# EasyEDA Pro project C题视觉追踪板子1.eprj, board PCB3
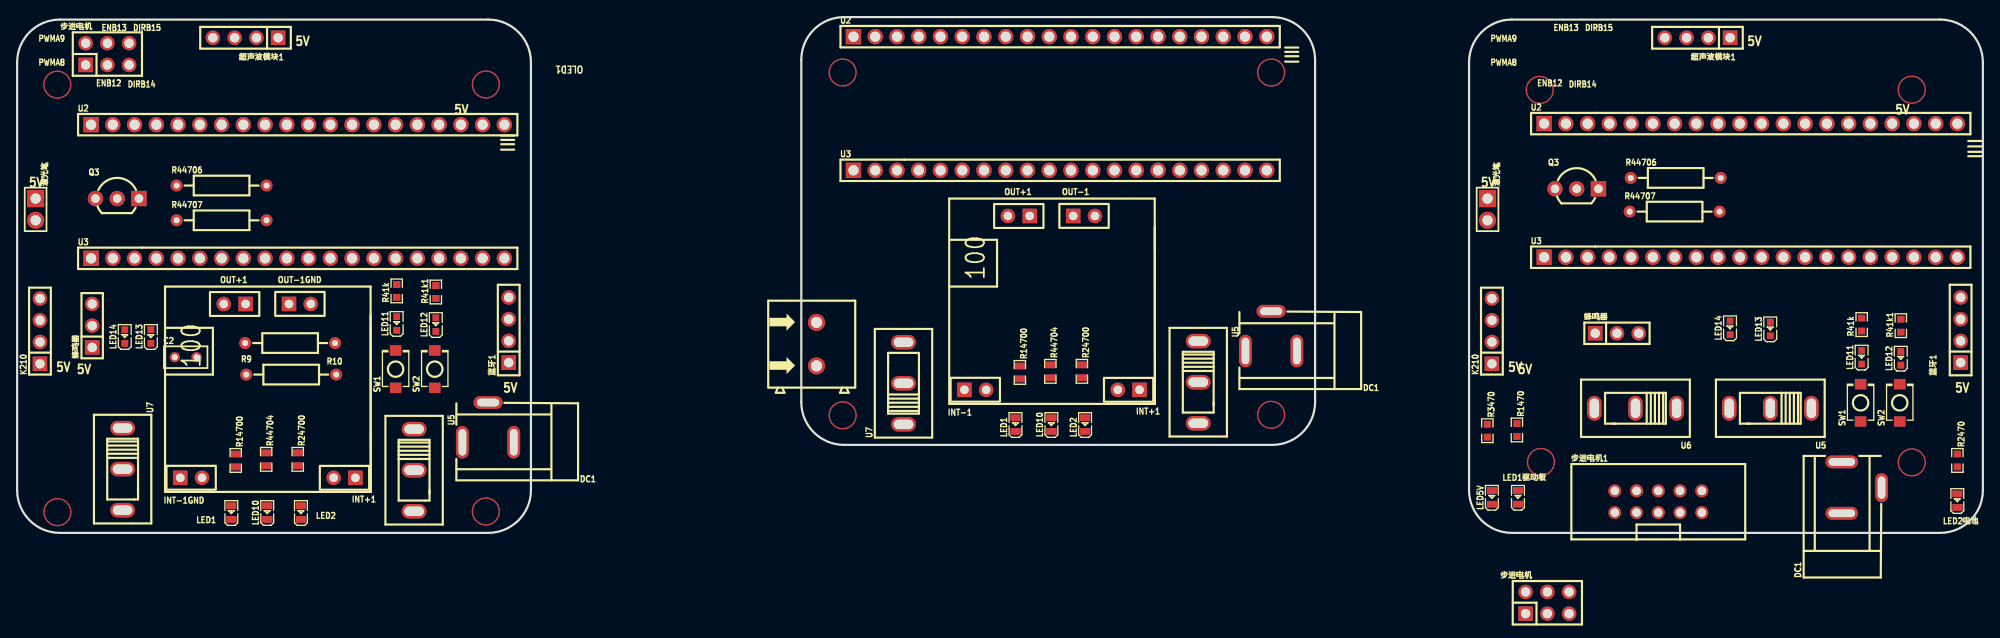
[diagram p4: board, top side]
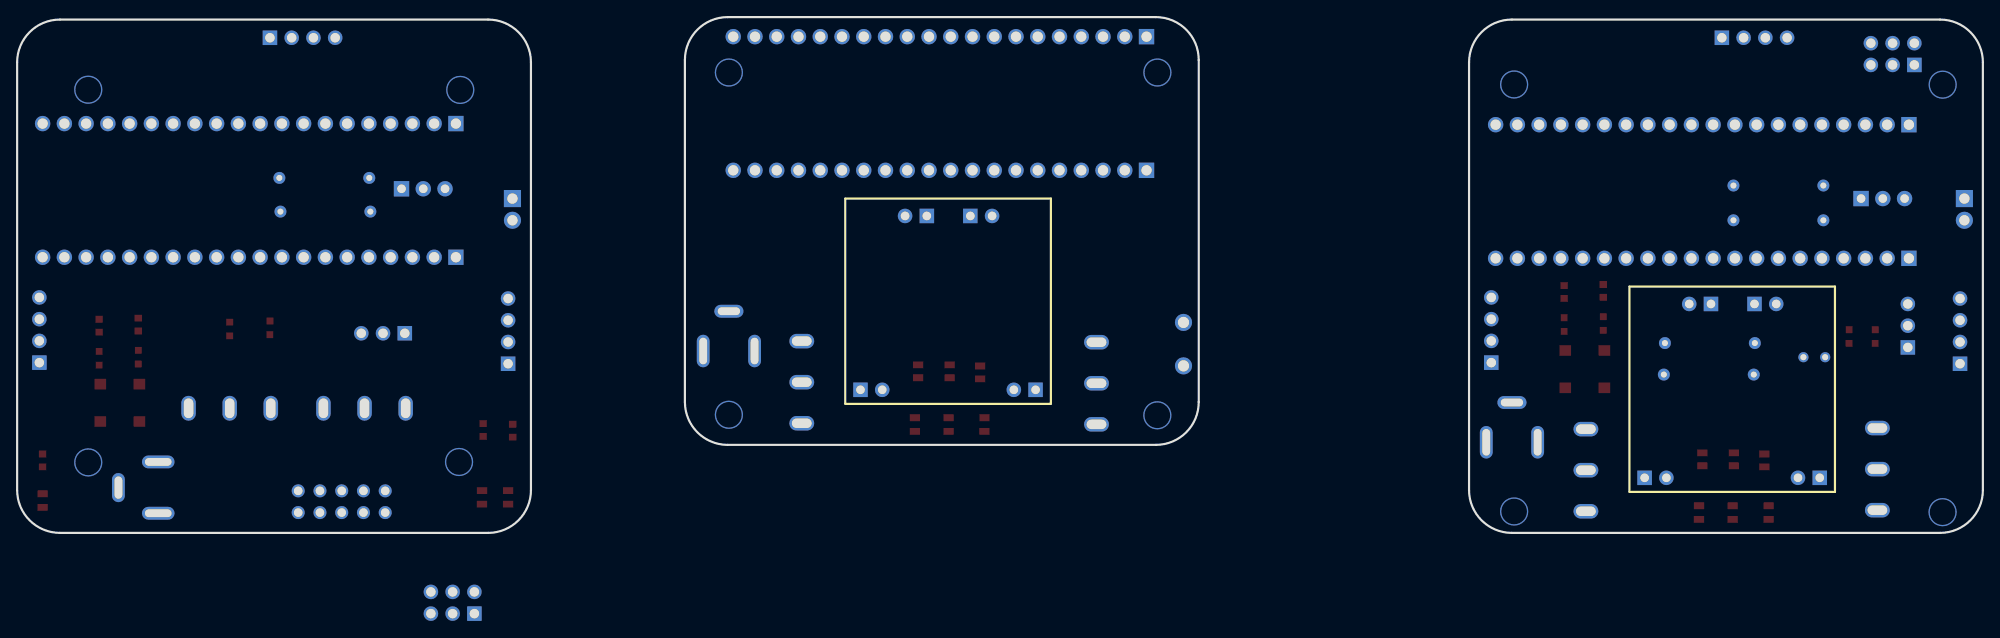
[diagram p5: board, bottom side, seen from below]

Outline 229.55 x 60.29 mm; copper layers: Top Layer, Bottom Layer. Coordinates in mm from the lower left corner of the outline.
Outline path: 0,55 0,5 arc(1.46,1.46) 5,0 55,0 arc(58.54,1.46) 60,5 60,55 arc(58.54,58.54) 55,60 5,60 arc(1.46,58.54) 0,55 ; 91.57,55.29 91.57,15.29 arc(93.03,11.75) 96.57,10.29 146.57,10.29 arc(150.1,11.75) 151.57,15.29 151.57,55.29 arc(150.1,58.82) 146.57,60.29 96.57,60.29 arc(93.03,58.82) 91.57,55.29 ; 169.54,55 169.54,5 arc(171.01,1.46) 174.54,0 224.55,0 arc(228.08,1.46) 229.55,5 229.55,55 arc(228.08,58.54) 224.55,60 174.54,60 arc(171.01,58.54) 169.54,55
Stack: Top Layer 0.035mm / Dielectric1 1.51mm FR4 er 4.5 / Bottom Layer 0.035mm

## Design rules (mm)
template: JLCPCB Capability(Two Layers Board)
spacing copperThickness1oz (default): track to track 0.102, other pairs 0.152 to 0.3
spacing copperThickness2oz: track to track 0.203, other pairs 0.152 to 0.3
track width copperThickness1oz (default): min 0.127, default 0.254, max 2.54
track width copperThickness2oz: min 0.203, default 0.254, max 2.54
differential pair differentialPair (default): width min 0.127, default 0.254, max 2.54; gap min 0.152, default 0.152
via viaSize (default): diameter min 0.5, default 0.61, max 10; hole min 0.3, default 0.305, max 6.3

## Placement (name value [footprint] x y rotation side)
C2  100nF  [rad-0.1]  19.68 20.54 0 top
DC1  -  [DC-IN-TH_DC-005-20A-1]  54.99 12.92 180 top
DC1#2  -  [DC-IN-TH_DC-005-20A-1]  215.39 5.3 90 top
DC1#3  -  [DC-IN-TH_DC-005-20A-1]  146.43 23.58 180 top
INT+1  -  [HDR-TH_2P-P2.54-V-F]  38.23 6.44 180 top
INT+1#2  -  [HDR-TH_2P-P2.54-V-F]  129.79 16.73 180 top
INT-1  2.54-1*2P母  [HDR-TH_2P-P2.54-V-F]  111.89 16.73 0 top
INT-1GND  2.54-1*2P母  [HDR-TH_2P-P2.54-V-F]  20.32 6.44 0 top
K210  -  [HDR-TH_4P-P2.54-V-M]  2.67 23.58 90 top
K210#2  -  [HDR-TH_4P-P2.54-V-M]  172.21 23.58 90 top
LED1  -  [LED0603-RD-YELLOW]  116.59 12.66 90 top
LED1#2  -  [LED0603-RD-YELLOW]  25.02 2.38 90 top
LED1驱动板  LTST-C191KSKT  [LED0603-RD-YELLOW]  175.26 4.15 90 top
LED2  -  [LED0603-RD-YELLOW]  33.15 2.38 90 top
LED2#2  -  [LED0603-RD-YELLOW]  124.71 12.66 90 top
LED2电池  LTST-C191KSKT  [LED0603-RD-YELLOW]  226.57 3.77 90 top
LED5V  LTST-C191KSKT  [LED0603-RD-YELLOW]  172.21 4.15 90 top
LED10  -  [LED0603-RD-YELLOW]  120.78 12.66 90 top
LED10#2  -  [LED0603-RD-YELLOW]  29.21 2.38 90 top
LED11  -  [LED0603-RD-YELLOW#2]  215.39 20.54 90 top
LED11#2  -  [LED0603-RD-YELLOW#2]  44.32 24.47 90 top
LED12  -  [LED0603-RD-YELLOW#2]  48.89 24.35 90 top
LED12#2  -  [LED0603-RD-YELLOW#2]  219.96 20.41 90 top
LED13  -  [LED0603-RD-YELLOW#2]  15.62 22.95 90 top
LED13#2  -  [LED0603-RD-YELLOW#2]  204.72 23.84 90 top
LED14  -  [LED0603-RD-YELLOW#2]  12.57 22.95 90 top
LED14#2  -  [LED0603-RD-YELLOW#2]  200.03 23.97 90 top
OUT+1  -  [HDR-TH_2P-P2.54-V-F]  25.4 26.76 180 top
OUT+1#2  -  [HDR-TH_2P-P2.54-V-F]  116.97 37.05 180 top
OUT-1  2.54-1*2P母  [HDR-TH_2P-P2.54-V-F]  124.59 37.05 0 top
OUT-1GND  2.54-1*2P母  [HDR-TH_2P-P2.54-V-F]  33.02 26.76 0 top
P1  WJ500V-5.08-2P  [CONN-TH_2P-P5.00_WJ500V-5.08-2P]  93.34 22.06 90 top
Q3  -  [TO-92-3_L4.8-W3.7-P2.54-R]  11.68 39.08 0 top
Q3#2  -  [TO-92-3_L4.8-W3.7-P2.54-R]  182.12 40.22 0 top
R9  10K  [RES-TH_BD2.3-L6.5-P10.50-D0.5]  32 18.5 0 top
R10  1kΩ  [RES-TH_BD2.3-L6.5-P10.50-D0.5]  31.88 22.19 180 top
R41k  -  [R0603#2]  44.32 28.28 90 top
R41k1  -  [R0603#2]  48.89 28.16 90 top
R41k1#2  -  [R0603#2]  219.96 24.22 90 top
R41k#2  -  [R0603#2]  215.39 24.35 90 top
R1470  470Ω  [R0603#2]  175.13 12.03 270 top
R2470  470Ω  [R0603#2]  226.57 8.47 270 top
R3470  470Ω  [R0603#2]  171.68 11.95 270 top
R14700  -  [R0603]  117.09 18.76 270 top
R14700#2  -  [R0603]  25.53 8.47 270 top
R24700  -  [R0603]  124.33 18.88 270 top
R24700#2  -  [R0603]  32.77 8.6 270 top
R44704  -  [R0603]  29.08 8.6 270 top
R44704#2  -  [R0603]  120.65 18.88 270 top
R44706  -  [RES-TH_BD2.3-L6.5-P10.50-D0.5]  23.88 40.6 0 top
R44706#2  -  [RES-TH_BD2.3-L6.5-P10.50-D0.5]  193.68 41.49 0 top
R44707  -  [RES-TH_BD2.3-L6.5-P10.50-D0.5]  23.88 36.54 0 top
R44707#2  -  [RES-TH_BD2.3-L6.5-P10.50-D0.5]  193.55 37.55 0 top
SW1  -  [SW-SMD_L3.9-W3.0-P4.45]  44.2 19.14 90 top
SW1#2  -  [SW-SMD_L3.9-W3.0-P4.45]  215.26 15.2 90 top
SW2  -  [SW-SMD_L3.9-W3.0-P4.45]  48.77 19.14 90 top
SW2#2  -  [SW-SMD_L3.9-W3.0-P4.45]  219.84 15.2 90 top
U2  -  [hdr-th_20p-p2.54-v-f]  32.77 47.71 0 top
U2#2  -  [hdr-th_20p-p2.54-v-f]  202.44 47.84 0 top
U2#3  -  [hdr-th_20p-p2.54-v-f]  121.79 58 0 top
U3  -  [hdr-th_20p-p2.54-v-f]  32.77 32.09 0 top
U3#2  -  [hdr-th_20p-p2.54-v-f]  202.44 32.22 0 top
U3#3  -  [hdr-th_20p-p2.54-v-f]  121.79 42.38 0 top
U5  -  [SW-TH_SHOU-HAN_SS12D10G4]  46.36 7.33 270 top
U5#2  -  [SW-TH_SHOU-HAN_SS12D10G4]  204.72 14.57 180 top
U5#3  -  [SW-TH_SHOU-HAN_SS12D10G4]  137.92 17.61 270 top
U6  SS12D10G5  [SW-TH_SHOU-HAN_SS12D10G4]  188.98 14.57 180 top
U7  -  [SW-TH_SHOU-HAN_SS12D10G4]  12.32 7.45 270 top
U7#2  -  [SW-TH_SHOU-HAN_SS12D10G4]  103.5 17.49 90 top
步进电机  -  [HDR-TH_6P-P2.54-V-M-R2-C3-S2.54]  10.54 55.97 0 top
步进电机1  2.54-2*5P简牛  [IDC-TH_10P-P2.54_C5665]  191.64 3.64 0 top
步进电机#2  -  [HDR-TH_6P-P2.54-V-M-R2-C3-S2.54]  178.69 -8.17 0 top
激光笔  -  [HDR-TH_2P-P2.54-V-M]  2.16 37.81 270 top
激光笔#2  -  [HDR-TH_2P-P2.54-V-M]  171.7 37.81 270 top
蓝牙1  -  [HDR-TH_4P-P2.54-V-F]  57.4 23.71 90 top
蓝牙1#2  -  [HDR-TH_4P-P2.54-V-F]  226.95 23.71 90 top
蜂鸣器  -  [HDR-TH_3P-P2.54-V-M]  8.76 24.22 90 top
蜂鸣器#2  -  [HDR-TH_3P-P2.54-V-M]  186.82 23.33 0 top
超声波模块1  -  [HDR-TH_4P-P2.54-V-F]  26.67 57.87 180 top
超声波模块1#2  -  [HDR-TH_4P-P2.54-V-F]  196.22 57.87 180 top

## Footprints (pads in the part's own frame, mm; a bottom-side part is the same pattern mirrored in y, then rotated)
CONN-TH_2P-P5.00_WJ500V-5.08-2P
  round 2 hole 1.3: 1(-2.54,0) 2(2.54,0)
DC-IN-TH_DC-005-20A-1
  oval 1.5x3.8 hole 0.9x3.1: 1(3,2.325) 2(-3,2.325)
  oval 3.4x1.5 hole 2.6x0.9: 3(0,-2.325)
HDR-TH_2P-P2.54-V-F
  rect 1.7x1.7 hole 1: 1(-1.27,0)
  round 1.7 hole 1: 2(1.27,0)
HDR-TH_2P-P2.54-V-M
  rect 2x2 hole 1.2: 1(-1.27,0)
  round 2 hole 1.2: 2(1.27,0)
HDR-TH_3P-P2.54-V-M
  rect 1.7x1.7 hole 1.1: 1(-2.54,0)
  round 1.7 hole 1.1: 2(0,0) 3(2.54,0)
HDR-TH_4P-P2.54-V-F
  rect 1.7x1.7 hole 1.1: 1(-3.81,0)
  round 1.7 hole 1.1: 2(-1.27,0) 3(1.27,0) 4(3.81,0)
HDR-TH_4P-P2.54-V-M
  rect 1.7x1.7 hole 1.1: 1(-3.81,0)
  round 1.7 hole 1.1: 2(-1.27,0) 3(1.27,0) 4(3.81,0)
HDR-TH_6P-P2.54-V-M-R2-C3-S2.54
  rect 1.7x1.7 hole 1.1: 1(-2.54,-1.27)
  round 1.7 hole 1.1: 2(-2.54,1.27) 3(0,-1.27) 4(0,1.27) 5(2.54,-1.27) 6(2.54,1.27)
hdr-th_20p-p2.54-v-f
  rect 1.8x1.8 hole 1.2: 1(-24.13,0)
  round 1.8 hole 1.2: 2(-21.59,0) 3(-19.05,0) 4(-16.51,0) 5(-13.97,0) 6(-11.43,0) 7(-8.89,0) 8(-6.35,0) 9(-3.81,0) 10(-1.27,0) 11(1.27,0) 12(3.81,0) 13(6.35,0) 14(8.89,0) 15(11.43,0) 16(13.97,0) 17(16.51,0) 18(19.05,0) 19(21.59,0) 20(24.13,0)
IDC-TH_10P-P2.54_C5665
  round 1.524 hole 1: 1(-5.08,-1.27) 2(-5.08,1.27) 3(-2.54,-1.27) 4(-2.54,1.27) 5(0,-1.27) 6(0,1.27) 7(2.54,-1.27) 8(2.54,1.27) 9(5.08,-1.27) 10(5.08,1.27)
LED0603-RD-YELLOW
  rect 0.8x1.2 smd: 1(-0.799,-0.004) 2(0.799,0.004)
LED0603-RD-YELLOW#2
  rect 0.8x0.8 smd: 1(-0.799,-0.004) 2(0.799,0.004)
R0603
  rect 0.806x1.2 smd: 1(-0.753,0) 2(0.753,0)
R0603#2
  rect 0.806x0.864 smd: 1(-0.753,0) 2(0.753,0)
rad-0.1
  round 1.194 hole 0.711: 1(-1.27,0) 2(1.27,0)
RES-TH_BD2.3-L6.5-P10.50-D0.5
  round 1.4 hole 0.7: 1(-5.25,0) 2(5.25,0)
SW-SMD_L3.9-W3.0-P4.45
  rect 1.23x1.36 smd: 1(-2.185,0) 2(2.185,0)
SW-TH_SHOU-HAN_SS12D10G4
  oval 1.7x2.9 hole 1.1x2.3: 1(-4.8,0) 2(0,0) 3(4.8,0)
TO-92-3_L4.8-W3.7-P2.54-R
  rect 1.8x1.8 hole 1: 1(2.54,0)
  round 1.8 hole 1: 2(0,0) 3(-2.54,0)

## Nets
3.3V: R41k.2 R41k1.2 R41k1#2.2 R41k#2.2 U2.20 U2#2.20 U2#3.20 U3.3 U3#2.3 U3#3.3
5V: K210.1 K210#2.1 OUT+1.1 OUT+1#2.1 R3470.1 R44704.1 R44704#2.1 U2.18 U2#2.18 U2#3.18 U5#2.1 U6.1 激光笔.1 激光笔#2.1 蓝牙1.1 蓝牙1#2.1 蜂鸣器.1 蜂鸣器#2.1 超声波模块1.1 超声波模块1#2.1
5V1: R1470.1 U6.2
12V: INT+1.1 INT+1#2.1 R9.2 R24700.1 R24700#2.1 U5.1 U5#3.1
12V1: P1.1 R14700.1 R14700#2.1 U7.1 U7#2.1
GND: C2.1 DC1.2 DC1.3 DC1#2.2 DC1#2.3 DC1#3.2 DC1#3.3 INT-1.1 INT-1GND.1 K210.2 K210#2.2 LED1.1 LED1#2.1 LED1驱动板.1 LED2.1 LED2#2.1 LED2电池.1 LED5V.1 LED10.1 LED10#2.1 LED13.1 LED13#2.1 LED14.1 LED14#2.1 OUT-1.1 OUT-1GND.1 P1.2 Q3.3 Q3#2.3 R10.1 SW1.1 SW1#2.1 SW2.1 SW2#2.1 U2.19 U2#2.19 U2#3.19 U3.1 U3.2 U3#2.1 U3#2.2 U3#3.1 U3#3.2 蓝牙1.2 蓝牙1#2.2 蜂鸣器.3 蜂鸣器#2.3 超声波模块1.4 超声波模块1#2.4
V5: DC1#2.1 R2470.1 U5#2.2
V12: DC1.1 DC1#3.1 U5.2 U5#3.2 U7.2 U7#2.2
PA0: U3.16 U3#2.16 U3#3.16
PA1: U3.15 U3#2.15 U3#3.15
PA2: K210.4 K210#2.4 U3.14 U3#2.14 U3#3.14
PA3: K210.3 K210#2.3 U3.13 U3#2.13 U3#3.13
PA4: U3.12 U3#2.12 U3#3.12 超声波模块1.2 超声波模块1#2.2
PA5: U3.11 U3#2.11 U3#3.11 超声波模块1.3 超声波模块1#2.3
PA6: LED13.2 LED13#2.2 U3.10 U3#2.10 U3#3.10
PA7: LED14.2 LED14#2.2 U3.9 U3#2.9 U3#3.9
PA8: U2.5 U2#2.5 U2#3.5 步进电机.1 步进电机#2.1
PA9: U2.6 U2#2.6 U2#3.6 步进电机.2 步进电机#2.2
PA10: U2.7 U2#2.7 U2#3.7
PA11: U2.8 U2#2.8 U2#3.8
PA12: U2.9 U2#2.9 U2#3.9
PA15: U2.10 U2#2.10 U2#3.10
PB0: U3.8 U3#2.8 U3#3.8
PB1: C2.2 R9.1 R10.2 U3.7 U3#2.7 U3#3.7
PB3: R44706.2 R44706#2.2 U2.11 U2#2.11 U2#3.11
PB4: U2.12 U2#2.12 U2#3.12 蜂鸣器.2 蜂鸣器#2.2
PB5: U2.13 U2#2.13 U2#3.13
PB6: U2.14 U2#2.14 U2#3.14 蓝牙1.4 蓝牙1#2.4
PB7: U2.15 U2#2.15 U2#3.15 蓝牙1.3 蓝牙1#2.3
PB8: LED11.1 LED11#2.1 SW1.2 SW1#2.2 U2.16 U2#2.16 U2#3.16
PB9: LED12.1 LED12#2.1 SW2.2 SW2#2.2 U2.17 U2#2.17 U2#3.17
PB10: U3.6 U3#2.6 U3#3.6
PB11: U3.5 U3#2.5 U3#3.5
PB12: U2.1 U2#2.1 U2#3.1 步进电机.3 步进电机#2.3
PB13: U2.2 U2#2.2 U2#3.2 步进电机.4 步进电机#2.4
PB14: U2.3 U2#2.3 U2#3.3 步进电机.5 步进电机#2.5
PB15: U2.4 U2#2.4 U2#3.4 步进电机.6 步进电机#2.6
PC13: U3.19 U3#2.19 U3#3.19
PC14: U3.18 U3#2.18 U3#3.18
PC15: U3.17 U3#2.17 U3#3.17
R: U3.4 U3#2.4 U3#3.4
VB: U3.20 U3#2.20 U3#3.20
$1N953: LED2.2 LED2#2.2 LED2电池.2 R2470.2 R24700.2 R24700#2.2
$1N998: LED1.2 LED1#2.2 LED1驱动板.2 R1470.2 R14700.2 R14700#2.2
$1N1457: LED5V.2 LED10.2 LED10#2.2 R3470.2 R44704.2 R44704#2.2
$1N2717: R44707.1 R44707#2.1 激光笔.2 激光笔#2.2
$1N2794: Q3.2 Q3#2.2 R44706.1 R44706#2.1
$1N2914: Q3.1 Q3#2.1 R44707.2 R44707#2.2
$1N3771: LED11.2 LED11#2.2 R41k.1 R41k#2.1
$1N4750: LED12.2 LED12#2.2 R41k1.1 R41k1#2.1

Pads without a net: INT+1 2; INT+1#2 2; INT-1 2; INT-1GND 2; OUT+1 2; OUT+1#2 2; OUT-1 2; OUT-1GND 2; U5 3; U5#2 3; U5#3 3; U6 3; U7 3; U7#2 3; 步进电机1 1 2 3 4 5 6 7 8 9 10

## Via types
v1: diameter 3.3, hole 3, Top Layer to Bottom Layer, 12 vias

## Routing (per net, layer and track width the routed paths; a pad name or vN(x,y) marks a point on that pad's centre or on a via; arc(x,y) is an arc through that point)
(no net):
  vias: v1(4.69,52.39) v1(4.71,2.42) v1(54.74,52.41) v1(54.74,2.5) v1(96.39,53.81) v1(96.4,13.75) v1(146.43,53.81) v1(146.43,13.8) v1(177.8,51.78) v1(177.94,8.29) v1(221.24,51.8) v1(221.24,8.24)

## Text on the board
Top Silkscreen Layer: PWMA9 | PWMA8 | ENB12 | ENB13 | DIRB14 | DIRB15 | OLED1 | 5V | 100
